# Altium schematic sheet POWER_SECTION.SchDoc
size A
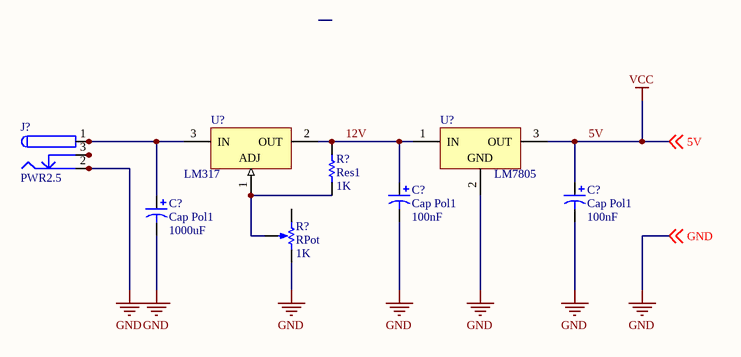
[diagram p0: POWER_SECTION.SchDoc]

## Parts
(Parts that share a designator on the sheet are numbered #1, #2 ... from top to bottom, then left to right.)
C?#1  Cap Pol1  value 100nF  [RB7.6-15]
C?#2  Cap Pol1  value 100nF  [RB7.6-15]
C?#3  Cap Pol1  value 1000uF  [RB7.6-15]
J?  PWR2.5  [KLD-0202]
R?#1  Res1  value 1K  [AXIAL-0.3]
R?#2  RPot  value 1K  [VR5]
U?#1  LM317  [KC03]
U?#2  LM7805  [KC03]

## Nets
5V: C?#2.1 U?#2.3(OUT) ; off-sheet 5V  [also labelled VCC]
GND: C?#1.2 C?#2.2 C?#3.2 J?.2 J?.2A J?.2B R?#2.2(BOT) U?#2.2(GND) ; off-sheet GND
12V: C?#1.1 R?#1.2 U?#1.2(OUT) U?#2.1(IN)
NetC?#3_1: C?#3.1 J?.1 J?.1A J?.1B U?#1.3(IN)
NetJ?_3: J?.3 J?.3A J?.3B
NetR?#1_1: R?#1.1 R?#2.3(TAP) U?#1.1(ADJ)

Not connected (* = marked no-connect by the designer): R?#2 1(TOP)

## Library data of the parts
C?#1-C?#3 = Cap Pol1: Polarized Capacitor (Radial); Published: 8-Jun-2000; LatestRevisionDate: 17-Jul-2002; LatestRevisionNote: Re-released for DXP Platform.; PackageReference: RB7.6-15; Publisher: Altium Limited; PackageDescription: Polarized Capacitor (Radial); 2 Leads
J? = PWR2.5: Low Voltage Power Supply Connector; Published: 17-Dec-2003; DatasheetDocument: 09-May-2002; Publisher: Altium Limited; ComponentLink1Description: Manufacturer Link; ComponentLink1URL: http://domino.kycon.com/internet/Products.html
R?#1 = Res1: Resistor; Published: 8-Jun-2000; LatestRevisionDate: 17-Jul-2002; LatestRevisionNote: Re-released for DXP Platform.; PackageReference: AXIAL-0.3; Publisher: Altium Limited; PackageDescription: Axial Device, Thru-Hole; 2 Leads; 0.3 in Pin Spacing
R?#2 = RPot: Potentiometer; Sim Note: Enter the Resistance value and the set point into parameter fields.; Set Position: 0.5; Published: 8-Jun-2000; LatestRevisionDate: 17-Jul-2002; LatestRevisionNote: Re-released for DXP Platform.; PackageReference: VR5; Publisher: Altium Limited; PackageDescription: Variable Resistor, Thru-Hole; 3 Leads
U?#1 = LM317KC: 3-Terminal Adjustable Regulator; Note: Pin 2 is electrically connected to tab; Published: 15-Apr-2002; DatasheetVersion: Feb-1988; PackageVersion: Sep-1995; PackageReference: KC03; Publisher: Altium Limited; PackageDescription: TO, Thru-Hole, Vertical, Heatsink Mounted; 3 In-Line Leads; Pitch 2.54 mm; ComponentLink1Description: Manufacturer Link; ComponentLink1URL: http://www.ti.com/
U?#2 = µA7805CKC: Positive-Voltage Regulator; Note: Pin 2 is electrically connected to TAB.; Published: 15-Apr-2002; DatasheetVersion: Jul-1999; PackageVersion: Sep-1995; PackageReference: KC03; Publisher: Altium Limited; PackageDescription: TO, Thru-Hole, Vertical, Heatsink Mounted; 3 In-Line Leads; Pitch 2.54 mm; ComponentLink1Description: Manufacturer Link; ComponentLink1URL: http://www.ti.com/; ComponentLink2Description: Datasheet; ComponentLink2URL: http://www-s.ti.com/sc/ds/ua7805.pdf